# EAGLE design Atmega-8-Burner (EAGLE 7.5.0)
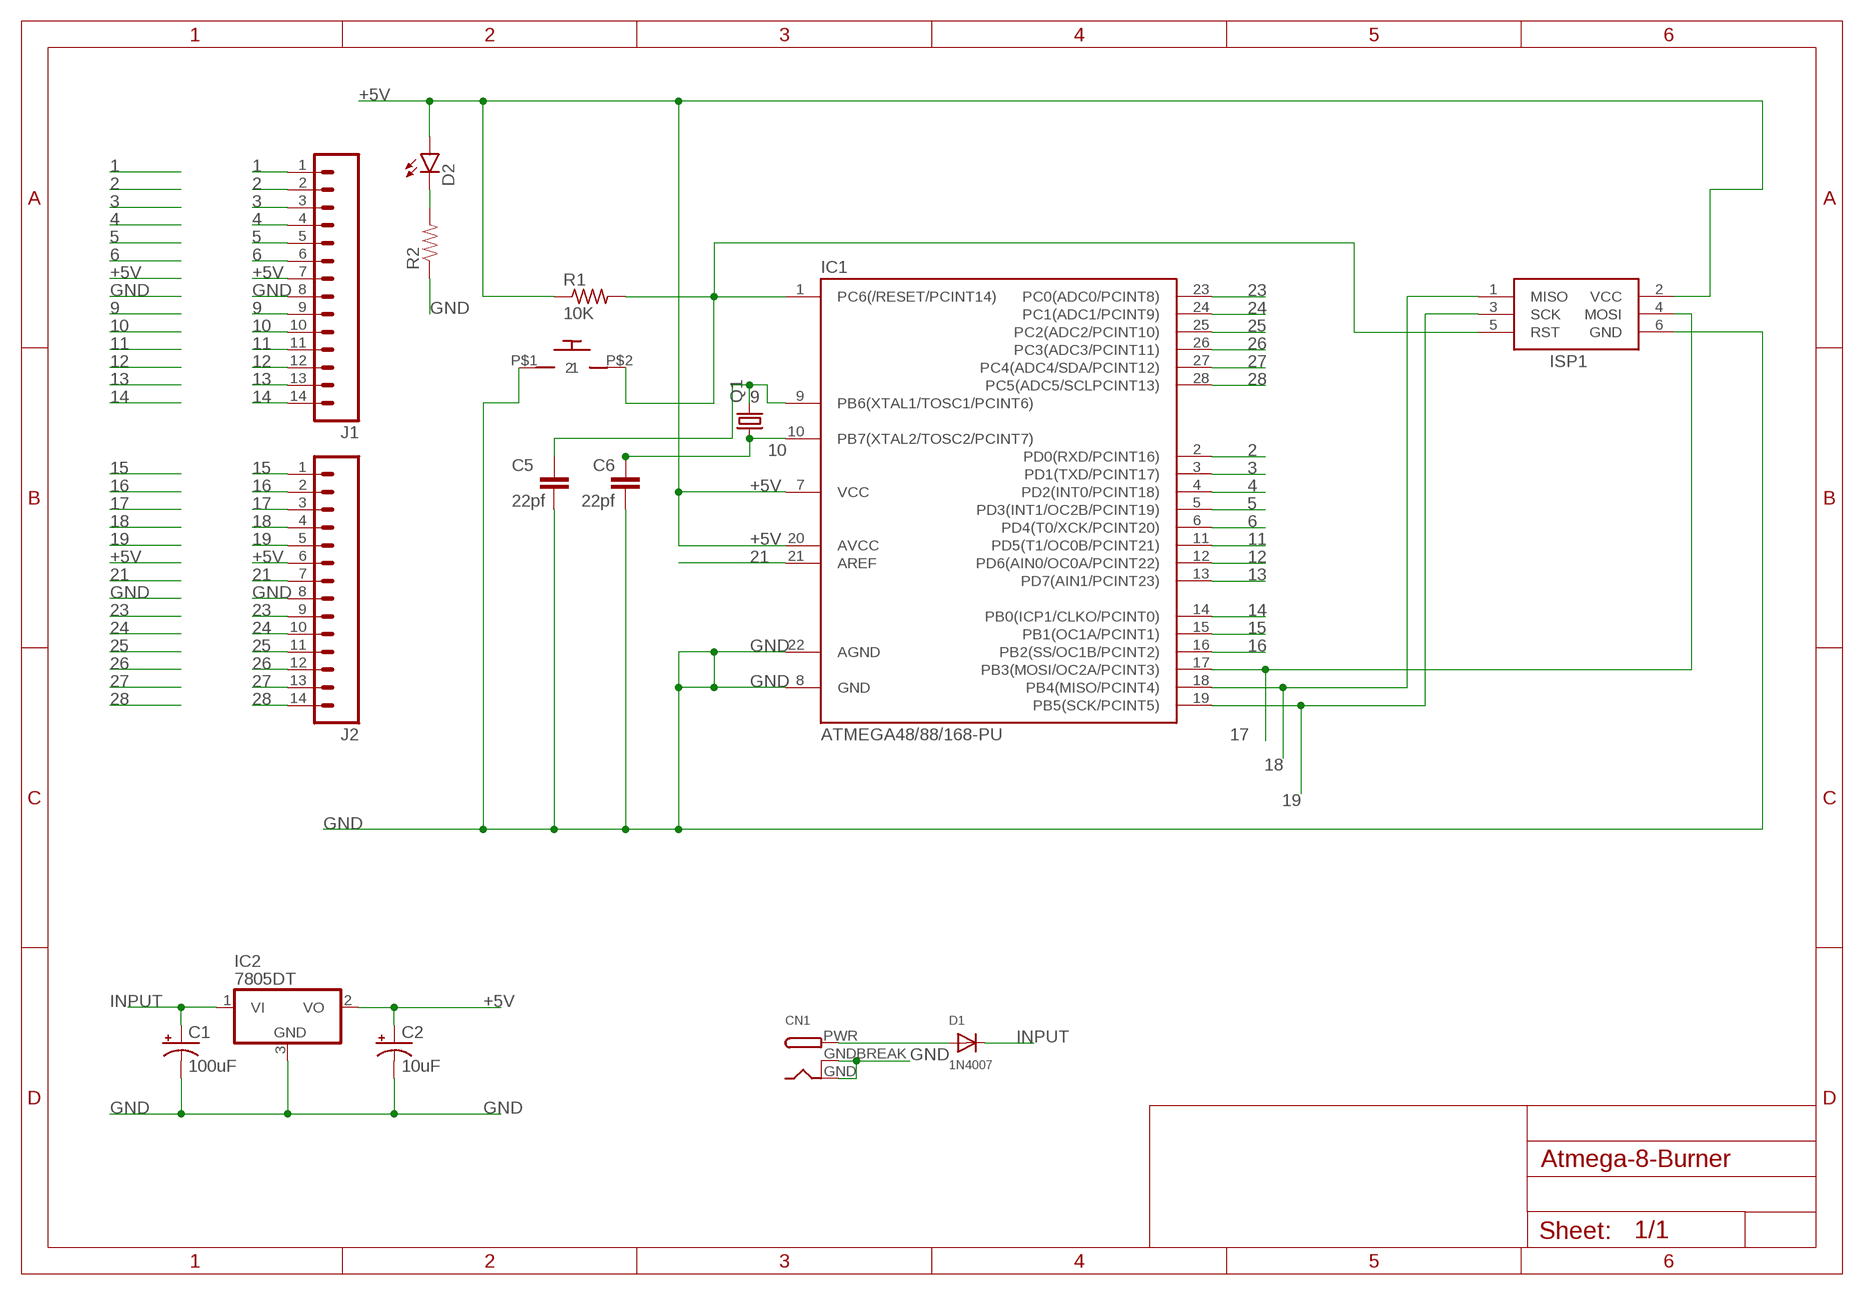
[diagram p0: schematic, sheet 1]

## Parts
C1  100uF  CAP_POLC  [PANASONIC_C]
C2  10uF  CAP_POLC  [PANASONIC_C]
C5  22pf  CAP0603-CAP  [0603-CAP]
C6  22pf  CAP0603-CAP  [0603-CAP]
CN1  DCBARRELPTH  [DCJACK_2MM_PTH]
D1  1N4007  DIODESMA  [SMADIODE]
D2  LED0603  [LED-0603]
IC1  ATMEGA48/88/168-PU  [DIL28-3]
IC2  7805DT  [TO252]
ISP1  AVRISP-6  [AVRISP]
J1  M14LOCK  [1X14_LOCK]
J2  M14LOCK  [1X14_LOCK]
Q1  CRYSTALHC49U-V  [HC49U-V]
R1  10K  R-US_R0603  [R0603]
R2  RESISTOR0603-RES  [0603-RES]
U$1  TAC_SWITCH  [TAC_SWITCH]

## Nets
1: IC1.1(PC6(/RESET/PCINT14)) ISP1.5(RST) J1.1 R1.2 U$1.P$2
2: IC1.2(PD0(RXD/PCINT16)) J1.2
3: IC1.3(PD1(TXD/PCINT17)) J1.3
4: IC1.4(PD2(INT0/PCINT18)) J1.4
5: IC1.5(PD3(INT1/OC2B/PCINT19)) J1.5
6: IC1.6(PD4(T0/XCK/PCINT20)) J1.6
9: C5.1 IC1.9(PB6(XTAL1/TOSC1/PCINT6)) J1.9 Q1.2
10: C6.1 IC1.10(PB7(XTAL2/TOSC2/PCINT7)) J1.10 Q1.1
11: IC1.11(PD5(T1/OC0B/PCINT21)) J1.11
12: IC1.12(PD6(AIN0/OC0A/PCINT22)) J1.12
13: IC1.13(PD7(AIN1/PCINT23)) J1.13
14: IC1.14(PB0(ICP1/CLKO/PCINT0)) J1.14
15: IC1.15(PB1(OC1A/PCINT1)) J2.1
16: IC1.16(PB2(SS/OC1B/PCINT2)) J2.2
17: IC1.17(PB3(MOSI/OC2A/PCINT3)) ISP1.4(MOSI) J2.3
18: IC1.18(PB4(MISO/PCINT4)) ISP1.1(MISO) J2.4
19: IC1.19(PB5(SCK/PCINT5)) ISP1.3(SCK) J2.5
21: IC1.21(AREF) J2.7
23: IC1.23(PC0(ADC0/PCINT8)) J2.9
24: IC1.24(PC1(ADC1/PCINT9)) J2.10
25: IC1.25(PC2(ADC2/PCINT10)) J2.11
26: IC1.26(PC3(ADC3/PCINT11)) J2.12
27: IC1.27(PC4(ADC4/SDA/PCINT12)) J2.13
28: IC1.28(PC5(ADC5/SCLPCINT13)) J2.14
+5V: C2.+ D2.A IC1.7(VCC) IC1.20(AVCC) IC2.2(VO) ISP1.2(VCC) J1.7 J2.6 R1.1
GND: C1.- C2.- C5.2 C6.2 CN1.GND CN1.GNDBREAK IC1.8(GND) IC1.22(AGND) IC2.3(GND) ISP1.6(GND) J1.8 J2.8 R2.1 U$1.P$1
INPUT: C1.+ D1.C IC2.1(VI)
N$1: CN1.PWR D1.A
N$2: D2.C R2.2

## Library data of the parts
C1 C2 = SparkFun-Passives:CAP_POL: Capacitor Polarized These are standard SMD and PTH capacitors. Normally 10uF, 47uF, and 100uF in electrolytic and tantalum varieties. Always verify the external diameter of the through hole cap, it varies with capacity, voltage, and manufacturer. The EIA devices should be standard.
C5 C6 = SparkFun-Capacitors:CAP: Capacitor Standard 0603 ceramic capacitor, and 0.1" leaded capacitor.
CN1 = adafruit:DCBARREL: 2.0mm DC Barrel Jack DCJACK_2MM_PTH - Through Hole Jack (4UConnector: 05537)
D1 = adafruit:DIODE: Diode SMADIODE - SMA Surface Mount Package 20V 1A Schottky Diode Digikey: 641-1014-6-ND DO-1N4148 - Through Hole Small Current Diode SOD-123 20V 1 A (.5mV Vf) Schottky Diode - Digikey: MBRX120TPMSCT-ND SOD-323 10V 570mA (.38mV Vf, 3ns) Schottky Diode - Digikey: ZLLS410CT-ND SOD-523 30V 30mA Schottky Diode (RB751S-40TE61) - Digikey: RB751S-40TE61CT-ND SOT23-R/W - SOT23 Package (R = Solder Paste/Reflow Ovens, W = Hand-Soldering) BAT54Film 40V 300mA - Digikey: 497-7162-1-ND
D2 = SparkFun-LED:LED: LEDs Standard schematic elements and footprints for 5mm, 3mm, 1206, and 0603 sized LEDs. 5mm - Spark Fun Electronics SKU : COM-00529 (and others)
IC1 = atmega8:ATMEGA48/88/168-PU
IC2 = adafruit:78*: Positive VOLTAGE REGULATOR Added bigger pads to the TO-92 package
ISP1 = adafruit:AVRISP: AVR ISP HEADER Standard 6 pin header for AVR programming
J1 J2 = SparkFun-Connectors:M14: Header 14 Standard 14-pin 0.1" header. Use with straight break away headers (SKU : PRT-00116), right angle break away headers (PRT-00553), swiss pins (PRT-00743), machine pins (PRT-00117), and female headers (PRT-00115).
Q1 = adafruit:CRYSTAL: CRYSTAL; OC_FARNELL: 1666969; OC_NEWARK: unknown
R1 = adafruit:R-US_: RESISTOR, American symbol
R2 = SparkFun-Passives:RESISTOR: Resistor Basic schematic elements and footprints for 0603, 1206, and PTH resistors.
U$1 = rohansagar:TAC_SWITCH

## Board
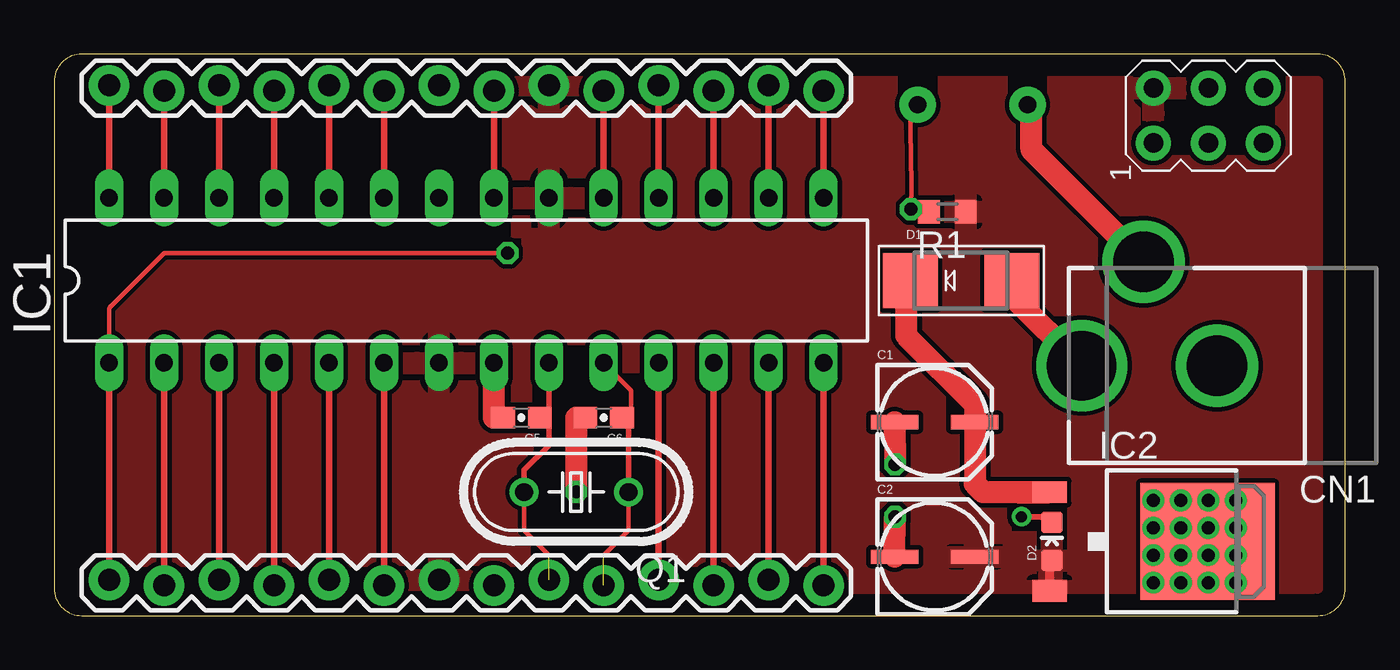
[diagram p1: board, top side]
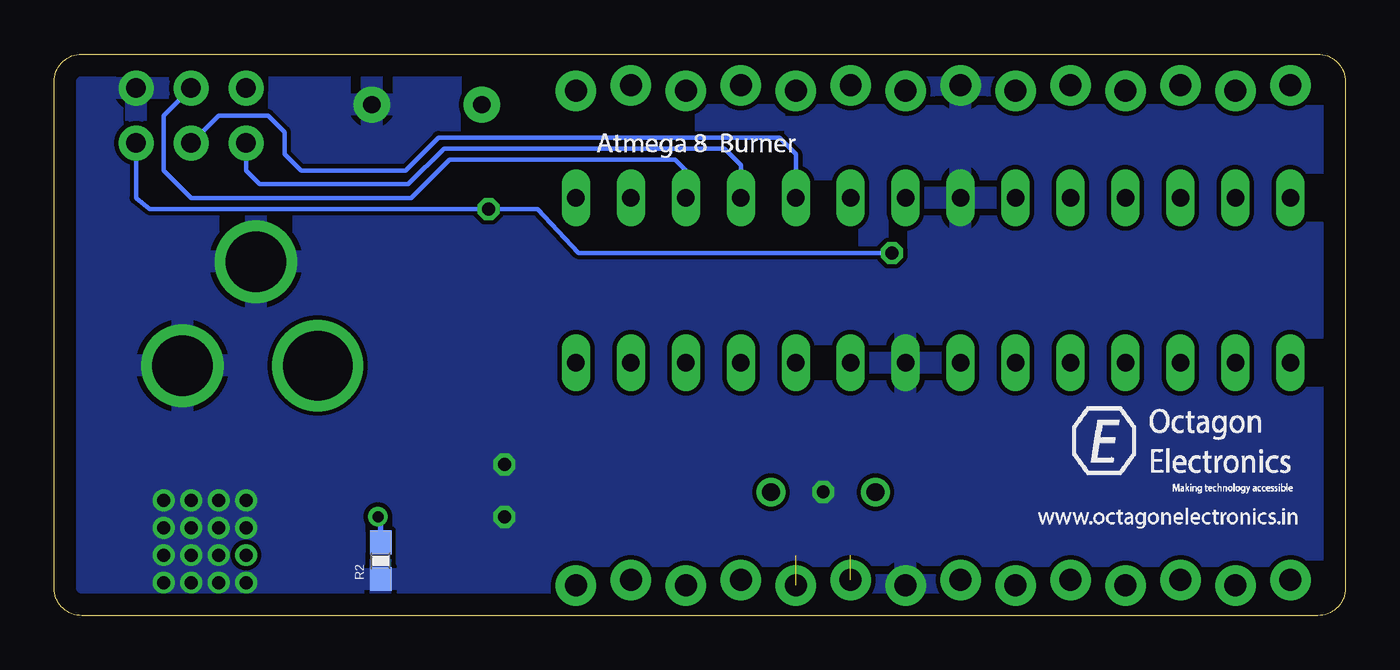
[diagram p2: board, bottom side, seen from below]

Size 59.67 x 25.96 mm. Coordinates in mm from the lower left corner, seen from the top.
Outline: 58.4,25.96 1.27,25.96 arc90 0,24.69 0,1.27 arc90 1.27,0 58.4,0 arc90 59.67,1.27 59.67,24.69 arc90 58.4,25.96
Copper layers (1*16): Top 0.035mm / dielectric 1.5mm / Bottom 0.035mm
Design rules "default": minimum track width 10mil, minimum drill 24mil, track to track 8mil, track to pad 8mil, pad to pad 8mil, via to via 8mil, smd to smd 8mil, copper to edge 40mil, drill to drill 8mil, minimum pad ring 10mil, minimum via ring 8mil, stop-mask expansion 4mil, vias tented up to drill 0mil, thermal gap 10mil

### Footprints (pad centres in the part's own frame; a part is rotated, then mirrored left to right if it is on the bottom)
PANASONIC_C = smd 2.2 x 0.65: + 1.9,-0.2; - -1.8,-0.2
0603-CAP = smd 1.1 x 1: 1 -0.85,0; 2 0.85,0
DCJACK_2MM_PTH = drill 2.8: GND 0,7.35; GNDBREAK 4.8,10.75 | drill 3.2: PWR 0,13.6
SMADIODE = smd 2.54 x 2.54: A 2.349,0; C -2.349,0
LED-0603 = smd 1 x 1: A 0,-0.877; C 0,0.877
DIL28-3 = drill 0.813 long: 1 -16.51,-3.81; 2 -13.97,-3.81; 3 -11.43,-3.81; 4 -8.89,-3.81; 5 -6.35,-3.81; 6 -3.81,-3.81; 7 -1.27,-3.81; 8 1.27,-3.81; 9 3.81,-3.81; 10 6.35,-3.81; 11 8.89,-3.81; 12 11.43,-3.81; 13 13.97,-3.81; 14 16.51,-3.81; 15 16.51,3.81; 16 13.97,3.81; 17 11.43,3.81; 18 8.89,3.81; 19 6.35,3.81; 20 3.81,3.81; 21 1.27,3.81; 22 -1.27,3.81; 23 -3.81,3.81; 24 -6.35,3.81; 25 -8.89,3.81; 26 -11.43,3.81; 27 -13.97,3.81; 28 -16.51,3.81
TO252 = smd 1 x 1.6: 1 -2.28,-4.8; 2 2.28,-4.8 | smd 5.4 x 6.2: 3 0,2.5
AVRISP = drill 0.9 pad 1.626: 1 -1.27,2.54; 2 1.27,2.54; 3 -1.27,0; 4 1.27,0; 5 -1.27,-2.54; 6 1.27,-2.54
1X14_LOCK = drill 1.016 pad 1.88: 1 0,0.127; 2 2.54,-0.127; 3 5.08,0.127; 4 7.62,-0.127; 5 10.16,0.127; 6 12.7,-0.127; 7 15.24,0.127; 8 17.78,-0.127; 9 20.32,0.127; 10 22.86,-0.127; 11 25.4,0.127; 12 27.94,-0.127; 13 30.48,0.127; 14 33.02,-0.127
HC49U-V = drill 0.813: 1 -2.413,0; 2 2.413,0
R0603 = smd 1 x 1.1: 1 -0.85,0; 2 0.85,0
0603-RES = smd 1.1 x 1: 1 -0.85,0; 2 0.85,0
TAC_SWITCH = drill 0.8 pad 1.676: P$1 -2.54,0; P$2 2.54,0

### Placement (x,y rotation side)
C1  40.64,9.14 0 top
C2  40.64,2.92 0 top
C5  21.59,9.14 180 top
C6  25.4,9.14 180 top
CN1  61.09,11.56 90 top
D1  41.91,15.49 0 top
D2  46.1,3.43 0 top
IC1  19.05,15.49 0 top
IC2  50.8,3.43 270 top
ISP1  53.34,23.11 90 top
J1  2.54,1.52 0 top
J2  35.56,24.38 180 top
Q1  24.13,5.71 180 top
R1  41.27,18.67 180 top
R2  44.58,2.54 90 bottom
U$1  42.44,23.62 180 top

### Tracks (layer width: path | path; a pad name or v marks a point on that pad's centre or on a via)
1  (via drill 0.6)
  Top 0.203: v39.6,18.8 39.62,19.91 39.57,22.45 39.57,23.29 U$1.P$2 | IC1.1 2.54,14.12 arc-45 2.61,14.3 5.08,16.76 v20.95,16.76
  Top 0.254: v39.6,18.8 40.42,18.8 R1.2
  Top 0.305: IC1.1 J1.1
  Bottom 0.203: v20.95,16.76 35.43,16.76 37.34,18.8 v39.6,18.8 55.24,18.8 55.88,19.3 ISP1.5
2
  Top 0.305: IC1.2 J1.2
3
  Top 0.305: IC1.3 J1.3
4
  Top 0.305: IC1.4 J1.4
5
  Top 0.305: IC1.5 J1.5
6
  Top 0.305: IC1.6 J1.6
9  (1 unrouted)
  Top 0.203: 22.86,2.79 21.72,3.94 Q1.2
  Top 0.254: IC1.9 22.86,9.56 C5.1 22.86,8.72 22.86,7.87 21.72,6.73 Q1.2
10  (1 unrouted)
  Top 0.203: IC1.10 26.67,10.41 26.67,9.56 C6.1 | Q1.1 26.54,3.94 25.4,2.79
  Top 0.254: Q1.1 26.54,8.85 C6.1
11
  Top 0.305: IC1.11 J1.11
12
  Top 0.305: IC1.12 J1.12
13
  Top 0.305: IC1.13 J1.13 33.02,1.52
14
  Top 0.305: IC1.14 J1.14
15
  Top 0.305: IC1.15 J2.1
16
  Top 0.305: IC1.16 J2.2
17
  Top 0.305: J2.3 IC1.17
  Bottom 0.203: IC1.17 30.48,20.57 30.99,21.08 41.4,21.08 43.18,19.3 53.34,19.3 54.61,20.57 54.61,23.11 ISP1.4
18
  Top 0.305: J2.4 IC1.18
  Bottom 0.203: 27.94,20.57 IC1.18 27.94,20.83 28.7,21.59 41.66,21.59 43.31,19.94 50.16,19.94 50.8,20.57 ISP1.1
19
  Top 0.305: J2.5 IC1.19
  Bottom 0.203: IC1.19 25.4,21.34 26.16,22.1 41.91,22.1 43.43,20.57 48.26,20.57 49.02,21.34 49.02,22.35 49.78,23.11 52.07,23.11 ISP1.3
21
  Top 0.305: J2.7 IC1.21
23
  Top 0.305: J2.9 IC1.23
24
  Top 0.305: J2.10 IC1.24
25
  Top 0.305: J2.11 IC1.25
26
  Top 0.305: J2.12 IC1.26
27
  Top 0.305: J2.13 IC1.27
28
  Top 0.305: J2.14 IC1.28
+5V
  Top 0.406: D2.A 46,2.4 IC2.2
  pour Top: 0,26.92 59.69,26.92 59.69,-1.02 0,-1.02
GND  (via drill 0.6)
  Top 0.406: v53.34,2.79 53.3,2.79 IC2.3
  Top 1.016: C5.2 20.32,9.14 IC1.8 | C6.2 24.13,9.14 v24.13,5.71 | C2.- v38.86,4.57 | C1.- v38.86,6.98 | CN1.GNDBREAK 45.16,21.53 45.16,23.44 U$1.P$1
  other vias: 50.8,5.33 52.07,5.33 53.34,5.33 54.61,5.33 50.8,4.06 52.07,4.06 53.34,4.06 54.61,4.06 54.61,2.79 52.07,2.79 50.8,1.52 52.07,1.52 53.34,1.52 54.61,1.52
  pour Bottom: 0,26.92 58.17,26.92 arc-90 59.69,25.4 59.69,-1.02 0,-0.76
INPUT
  Top 1.016: D1.C 39.37,15.3 39.37,12.95 42.54,9.78 C1.+ 42.54,6.1 42.93,5.71 IC2.1 44.5,5.71
N$1
  Top 1.016: CN1.PWR 44.26,14.78 D1.A
N$2  (via drill 0.5 pad 0.25)
  Top 0.254: D2.C 45.58,4.57 v44.7,4.57
  Bottom 0.254: v44.7,4.57 44.58,4.45 R2.2
N$12  (via drill 0.6)
  other vias: 50.8,2.79

### Text on the board
Top: TOP
Bottom: BOT
tPlace: Atmega 8 Burner | T SILK | Note: Solder mask is Black
bPlace: B SILK